# EasyEDA Pro project G431CBU6最小系统板_v2.0_RT9013-33GB_2024-07-07.epro

# Schematic G431CBU6最小系统板
Create Date: 2024-06-30; Page Name: P1; Project Name: G431CBU6; Schematic Name: G431CBU6最小系统板; Update Date: 2024-07-07; Company: 无线电爱好者协会; Drawed: wuneng; Page Size: A4; Version: V2.0
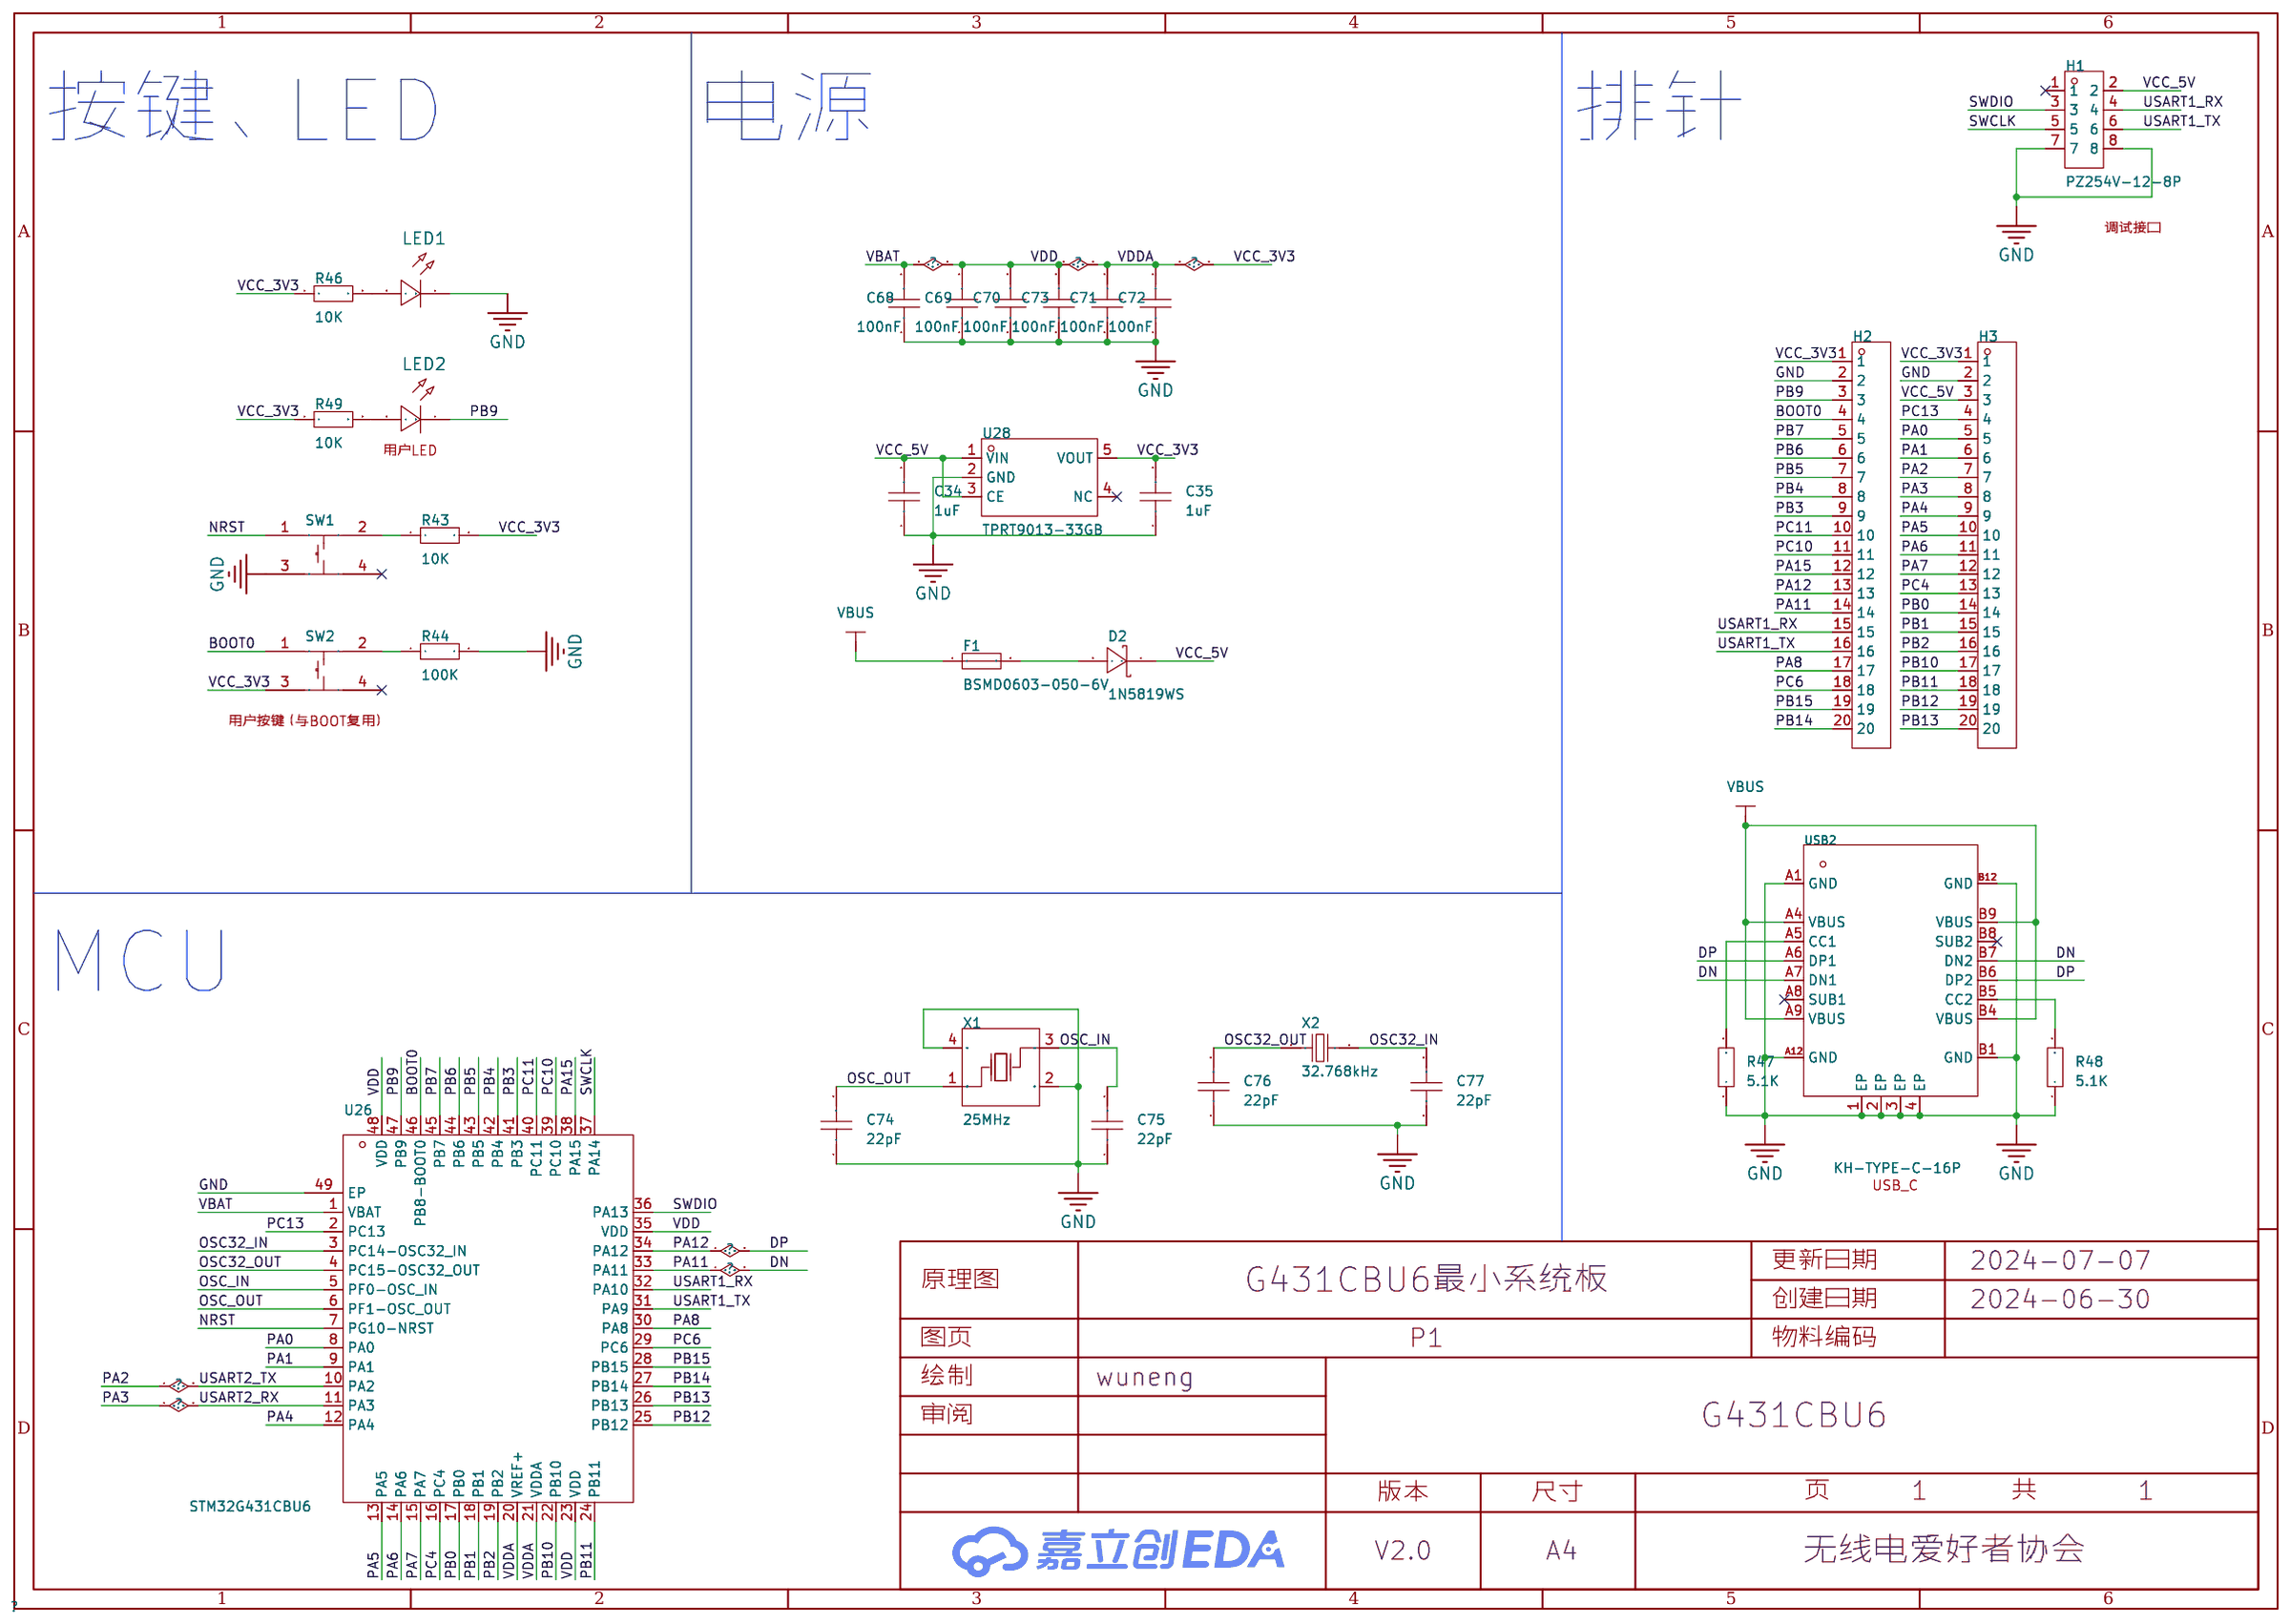
[diagram p0: schematic sheet]

## Parts
C34  1uF  [C0603]
C35  1uF  [C0603]
C68  100nF  [C0603]
C69  100nF  [C0603]
C70  100nF  [C0603]
C71  100nF  [C0603]
C72  100nF  [C0603]
C73  100nF  [C0603]
C74  22pF  [C0402]
C75  22pF  [C0402]
C76  22pF  [C0402]
C77  22pF  [C0402]
D2  1N5819WS  [SOD-323_L1.8-W1.3-LS2.5-RD]
F1  BSMD0603-050-6V  [F0603]
H1  PZ254V-12-8P  [HDR-TH_8P-P2.54-V-M-R2-C4-S2.54]
H2  X6511WV-20H-C60D30  [HDR-TH_20P-P2.54-V-M]
H3  X6511WV-20H-C60D30  [HDR-TH_20P-P2.54-V-M]
LED1  -  [LED_0603]
LED2  -  [LED_0603]
R43  10K  [R0603]
R44  100K  [R0603]
R46  10K  [R0603]
R47  5.1K  [R0603]
R48  5.1K  [R0603]
R49  10K  [R0603]
SW1  K2-1808SN-A3SW-01  [SW-SMD_4P-L4.2-W3.3-P2.15-LS5.1]
SW2  K2-1808SN-A3SW-01  [SW-SMD_4P-L4.2-W3.3-P2.15-LS5.1]
U26  STM32G431CBU6  [UFQFPN-48_L7.0-W7.0-P0.50-BL-EP]
U28  TPRT9013-33GB  [SOT-23-5_L3.0-W1.7-P0.95-LS2.8-BL]
USB2  KH-TYPE-C-16P  [USB-C-SMD_KH-TYPE-C-16P]
X1  25MHz  [OSC-SMD_4P-L3.2-W2.5-BL]
X2  32.768kHz  [FC-135R_L3.2-W1.5]

## Library data of the parts
C34 C35 C68-C73 = CAP_0603: Supplier Footprint: 0603
C74-C77 = CAP_0402: Supplier Footprint: 0402
D2 = 1N5819WS_C191023: 正向压降(Vf):600mV@1A;直流反向耐压(Vr):40V;平均整流电流(Io):1A;; LCSC Part Name: 电压:40V 电流:1A; Supplier Part: C191023; Manufacturer: Hottech(合科泰); Supplier Footprint: SOD-323; JLCPCB Part Class: 基础库; Datasheet: https://atta.szlcsc.com/upload/public/pdf/source/20220428/3CB86FD8D28D653594B4E35F9D5AEFD9.pdf; Supplier: LCSC; Forward Voltage (Vf@If): 600mV@1A; Reverse Voltage (Vr): 40V; Average Rectified Current (Io): 1A
F1 = BSMD0603-050-6V: 最大电压:6V;最大电流:40A;保持电流:500mA;跳闸电流:1A;; LCSC Part Name: 6V 500mA 0603自恢复; Supplier Part: C883095; Manufacturer: BHFUSE(佰宏); Supplier Footprint: 0603; JLCPCB Part Class: 扩展库; Datasheet: https://atta.szlcsc.com/upload/public/pdf/source/20230512/E478DE3555A0061DA0124A9F45802B86.pdf; Supplier: LCSC; Operating Voltage (Max): 6V; Current Rating (Max): 40A; Hold Current: 500mA; Trip Current: 1A; Power Dissipation: 500mW; Resistance - Initial (Ri) (Min): 100mΩ; Resistance - Post Trip (R1) (Max): 800mΩ; Maximum Time to Trip: 100ms; Operating Temperature: -40℃~+85℃
H1 = PZ254V-12-8P: 插针结构:2x4P;间距:2.54mm;行距:2.54mm;圆针/方针:方针;安装类型:直插;排数:双排;总PIN位数:8P;额定电流:-;额定电压:-;配合针长度:6mm;塑高:2.5mm;端接针长度:3mm;触头材质:黄铜;触头镀层:-;工作温度范围:-40℃~+105℃;颜色:黑色;; LCSC Part Name: 间距:2.54mm 2x4P 直插 方针; Supplier Part: C492421; Manufacturer: XFCN(兴飞); Supplier Footprint: 插件,P=2.54mm; JLCPCB Part Class: 扩展库; Datasheet: https://atta.szlcsc.com/upload/public/pdf/source/20200309/C492421_DC8A206AF99CD7755BD4A5B0BC48200B.pdf; Supplier: LCSC; Pin Structure: 2x4P; Pitch: 2.54mm; Row Spacing: 2.54mm; Circluar Pins/Square Pins: 方针; Mounting Type: 直插; Number of Rows: 双排; Number of Pins: 8P; Length of Mating Pin: 6mm; Insulation Height: 2.5mm; Length of End Connection Pin: 3mm; Contact Material: 黄铜; Operating Temperature Range: -40℃~+105℃; Color: 黑色
H2 H3 = X6511WV-20H-C60D30: 插针结构:1x20P;间距:2.54mm;行距:2.54mm;圆针/方针:方针;安装类型:-;排数:单排;总PIN位数:20P;额定电流:3A;额定电压:250V;配合针长度:6mm;塑高:2.5mm;端接针长度:3mm;触头材质:黄铜;触头镀层:金;工作温度范围:-40℃~+105℃;焊接温度(最大值):260℃;颜色:黑色;; LCSC Part Name: 1x20P 间距:2.54mm 方针; Supplier Part: C725952; Manufacturer: XKB Connection(中国星坤); Supplier Footprint: 插件,P=2.54mm; JLCPCB Part Class: 扩展库; Datasheet: https://atta.szlcsc.com/upload/public/pdf/source/20221108/2FDDF9C694C8EDC81165E23F2EAAE597.pdf; Supplier: LCSC; Pin Structure: 1x20P; Pitch: 2.54mm; Row Spacing: 2.54mm; Circluar Pins/Square Pins: 方针; Number of Rows: 单排; Number of Pins: 20P; Current Rating (Max): 3A; Voltage Rating (Max): 250V; Length of Mating Pin: 6mm; Insulation Height: 2.5mm; Length of End Connection Pin: 3mm; Contact Material: 黄铜; Contact Plating: 金; Operating Temperature Range: -40℃~+105℃; Soldering Temperature(Max): 260℃; Color: 黑色
LED1 LED2 = LED_0603-R: Supplier Footprint: 0603
R43 R44 R46-R49 = Res_0603: Supplier Footprint: 0603
SW1 SW2 = K2-1808SN-A3SW-01: 作用力:180gf;安装方式:立贴;开关长度:4.2mm;开关宽度:3.25mm;开关高度:2.5mm;触点电流:50mA;额定电压(DC):12V;绝缘电阻:100MΩ;机械寿命:10万次;; LCSC Part Name: 3*4*2.5 贴片开关180G; Supplier Part: C2690012; Manufacturer: 韩国韩荣; Supplier Footprint: SMD; JLCPCB Part Class: 扩展库; Datasheet: https://atta.szlcsc.com/upload/public/pdf/source/20180927/C283535_7E7907F3E7B6C1691E1DC87E363D082A.pdf; Supplier: LCSC; Operating Force: 180gf; Mounting Style: 立贴; Switch Length: 4.2mm; Switch Width: 3.25mm; Switch Height: 2.5mm; Contact Current: 50mA; Voltage Rating (DC): 12V; Insulation Resistance: 100MΩ; Mechanical Life: 10万次; Operating Temperature: -25℃~+85℃
U26 = STM32G431CBU6: CPU内核:ARM-M系列;程序存储容量:128KB;RAM总容量:32KB;GPIO端口数量:42;工作电压范围:1.71V~3.6V;CPU最大主频:170MHz;程序存储器类型:FLASH;; Supplier Part: C529356; Manufacturer: ST(意法半导体); Supplier Footprint: UFQFPN-48(7x7); JLCPCB Part Class: 扩展库; Datasheet: https://atta.szlcsc.com/upload/public/pdf/source/20200511/C529354_7C66CF00837B904D0C15DCE45B69418C.pdf; Supplier: LCSC; CPU Core: ARM-M系列; Program Storage Size: 128KB; RAM Size: 32KB; GPIO Ports Number: 42; Operating Voltage Range: 1.71V~3.6V; CPU Maximum Speed: 170MHz; Program Memory Type: FLASH; Operating Temperature Range: -40℃~+85℃; ADC (Bit): 12bit; DAC (Bit): 12bit; Peripheral/Function: DMA；PWM; Watchdog: 有; Infrared Data Association: 有; Low-Voltage Detect: 有; Direct Memory Access: 有; Internal Oscillator: 有
U28 = TPRT9013-33GB: 输出类型:-;; Supplier Part: C587158; Manufacturer: TECH PUBLIC(台舟); Supplier Footprint: SOT-23-5; JLCPCB Part Class: 扩展库; Datasheet: https://atta.szlcsc.com/upload/public/pdf/source/20210810/692D4D0C3CF190F9330EFD28C3E572CB.pdf; Supplier: LCSC
USB2 = KH-TYPE-C-16P: Type-C母座 16PIN 立式四角贴板无压片; LCSC Part Name: Type-C母座; Supplier Part: C709357; Manufacturer: kinghelm(金航标); JLCPCB Part Class: Extended Part; Datasheet: https://atta.szlcsc.com/upload/public/pdf/source/20200911/C709357_AA8DCEB38BB20E3035A7ED7AE7667837.pdf; Supplier: LCSC; Connector Type: Type-C; Gender: 母; Number of Ports: 1; Number of Contacts: 16P; Mounting Style: 卧贴; Current Rating - Power (Max): 3A; Operating Temperature Range: -40℃~+85℃
X1 = X322525MOB4SI: 晶振类型:贴片晶振;频率:25MHz;常温频差:±10ppm;外接负载电容:12pF;频率稳定度(全温):±20ppm;; LCSC Part Name: 25MHz ±10ppm 12pF; Supplier Part: C9006; Manufacturer: YXC(扬兴晶振); Supplier Footprint: SMD3225-4P; JLCPCB Part Class: 基础库; Datasheet: https://atta.szlcsc.com/upload/public/pdf/source/20240329/19D5F850207469550BEB00D7DFEDBC7A.pdf; Supplier: LCSC; Crystal Type: 贴片晶振; Normal temperature Frequency Tolerance: ±10ppm; External load capacitor: 12pF; Frequency Stability(Full temperature range): ±20ppm; Operating Temperature: -40℃~+85℃
X2 = Q13FC13500004_C32346: 晶振类型:贴片晶振;频率:32.768kHz;常温频差:±20ppm;外接负载电容:12.5pF;; LCSC Part Name: 32.768kHz ±20ppm 12.5pF; Supplier Part: C32346; Manufacturer: EPSON(爱普生); Manufacturer Part: Q13FC13500004; Supplier Footprint: SMD3215-2P; JLCPCB Part Class: Basic Part; Datasheet: https://atta.szlcsc.com/upload/public/pdf/source/20240418/0E0FF5F0356BA3753F616001439D1416.pdf; Supplier: LCSC; Crystal Type: 贴片晶振; Normal temperature Frequency Tolerance: ±20ppm; External load capacitor: 12.5pF; Equivalent Series Resistance (ESR): 70kΩ; Operating Temperature: -40℃~+85℃

## Nets
GND: C34.1 C35.1 C68.1 C69.1 C70.1 C71.1 C72.1 C73.1 C74.1 C75.1 C76.1 C77.1 H1.7 H1.8 H2.2 H3.2 LED1.1(C) R44.2 R47.1 R48.1 SW1.3 U26.49(EP) U28.2(GND) USB2.1(EP) USB2.2(EP) USB2.3(EP) USB2.4(EP) USB2.A1(GND) USB2.A12(GND) USB2.B1(GND) USB2.B12(GND) X1.2(GND) X1.4(GND)
VBAT: C35.2 C68.2 C69.2 C70.2 C71.2 C72.2 C73.2 H2.1 H3.1 R43.2 R46.1 R49.1 SW2.3 U26.1(VBAT) U26.20(VREF+) U26.21(VDDA) U26.23(VDD) U26.35(VDD) U26.48(VDD) U28.5(VOUT)
VBUS: F1.1 USB2.A4(VBUS) USB2.A9(VBUS) USB2.B4(VBUS) USB2.B9(VBUS)
VCC_5V: C34.2 D2.1(K) H1.2 H3.3 U28.1(VIN) U28.3(CE)
BOOT0: H2.4 SW2.1 U26.46(PB8-BOOT0)
DN: H2.14 U26.33(PA11) USB2.A7(DN1) USB2.B7(DN2)
DP: H2.13 U26.34(PA12) USB2.A6(DP1) USB2.B6(DP2)
NRST: SW1.1 U26.7(PG10-NRST)
OSC32_IN: C77.2 U26.3(PC14-OSC32_IN) X2.2
OSC32_OUT: C76.2 U26.4(PC15-OSC32_OUT) X2.1
OSC_IN: C75.2 U26.5(PF0-OSC_IN) X1.3(OSC2)
OSC_OUT: C74.2 U26.6(PF1-OSC_OUT) X1.1(OSC1)
PA0: H3.5 U26.8(PA0)
PA1: H3.6 U26.9(PA1)
PA2: H3.7 U26.10(PA2)
PA3: H3.8 U26.11(PA3)
PA4: H3.9 U26.12(PA4)
PA5: H3.10 U26.13(PA5)
PA6: H3.11 U26.14(PA6)
PA7: H3.12 U26.15(PA7)
PA8: H2.17 U26.30(PA8)
PA15: H2.12 U26.38(PA15)
PB0: H3.14 U26.17(PB0)
PB1: H3.15 U26.18(PB1)
PB2: H3.16 U26.19(PB2)
PB3: H2.9 U26.41(PB3)
PB4: H2.8 U26.42(PB4)
PB5: H2.7 U26.43(PB5)
PB6: H2.6 U26.44(PB6)
PB7: H2.5 U26.45(PB7)
PB9: H2.3 LED2.1(C) U26.47(PB9)
PB10: H3.17 U26.22(PB10)
PB11: H3.18 U26.24(PB11)
PB12: H3.19 U26.25(PB12)
PB13: H3.20 U26.26(PB13)
PB14: H2.20 U26.27(PB14)
PB15: H2.19 U26.28(PB15)
PC4: H3.13 U26.16(PC4)
PC6: H2.18 U26.29(PC6)
PC10: H2.11 U26.39(PC10)
PC11: H2.10 U26.40(PC11)
PC13: H3.4 U26.2(PC13)
SWCLK: H1.5 U26.37(PA14)
SWDIO: H1.3 U26.36(PA13)
USART1_RX: H1.4 H2.15 U26.32(PA10)
USART1_TX: H1.6 H2.16 U26.31(PA9)
$1N959: R43.1 SW1.2
$1N967: R44.1 SW2.2
$1N3403: D2.2(A) F1.2
$1N5948: LED1.2(A) R46.2
$1N7792: R48.2 USB2.B5(CC2)
$1N7796: R47.2 USB2.A5(CC1)
$1N10454: LED2.2(A) R49.2

Not connected (* = marked no-connect by the designer): H1 1*; SW1 4*; SW2 4*; U28 4(NC)*; USB2 A8(SUB1)* B8(SUB2)*

## Notes on the sheet
- 按键、LED
- 电源
- 排针
- 调试接口
- 用户LED
- 用户按键（与BOOT复用）
- MCU
- USB_C

# Board G431CBU6最小系统板
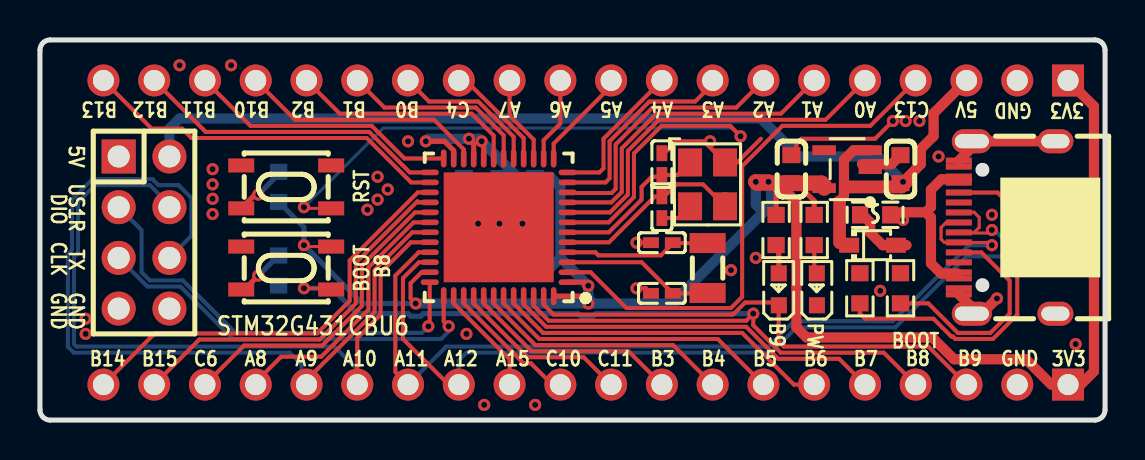
[diagram p1: board, top side]
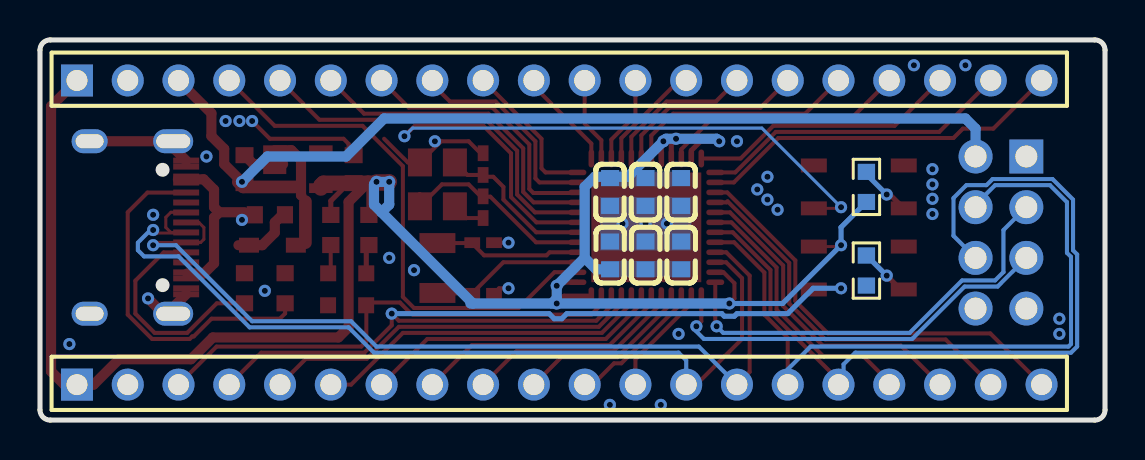
[diagram p2: board, bottom side, seen from below]

Outline 53.29 x 19.05 mm; copper layers: Top Layer, Bottom Layer. Coordinates in mm from the lower left corner of the outline.
Outline path: 0,18.54 0,0.51 arc(0.15,0.15) 0.51,0 52.78,0 arc(53.14,0.15) 53.29,0.51 53.29,18.54 arc(53.14,18.9) 52.78,19.05 0.51,19.05 arc(0.15,18.9) 0,18.54
Stack: Top Layer 0.035mm / Dielectric1 1.51mm FR4 er 4.5 / Bottom Layer 0.035mm

## Design rules (mm)
template: JLCPCB Capability(Two Layers Board)
spacing copperThickness1oz (default): track to track 0.102, other pairs 0.152 to 0.3
spacing copperThickness2oz: track to track 0.203, other pairs 0.152 to 0.3
track width copperThickness1oz (default): min 0.127, default 0.254, max 2.54
track width copperThickness2oz: min 0.203, default 0.254, max 2.54
differential pair differentialPair (default): width min 0.127, default 0.254, max 2.54; gap min 0.152, default 0.152
via viaSize (default): diameter min 0.5, default 0.61, max 10; hole min 0.3, default 0.305, max 6.3

## Placement (name value [footprint] x y rotation side)
C34  1uF  [C0603]  43.05 12.57 270 top
C35  1uF  [C0603]  37.59 12.57 270 top
C68  100nF  [C0603]  22.99 11.43 90 bottom
C69  100nF  [C0603]  24.77 11.43 90 bottom
C70  100nF  [C0603]  21.21 11.43 90 bottom
C71  100nF  [C0603]  22.99 8.26 270 bottom
C72  100nF  [C0603]  24.77 8.26 270 bottom
C73  100nF  [C0603]  21.21 8.26 270 bottom
C74  22pF  [C0402]  31.11 12.83 270 top
C75  22pF  [C0402]  31.11 10.67 90 top
C76  22pF  [C0402]  31.11 8.89 0 top
C77  22pF  [C0402]  31.11 6.35 0 top
D2  1N5819WS  [SOD-323_L1.8-W1.3-LS2.5-RD]  41.66 8.76 0 top
F1  BSMD0603-050-6V  [F0603]  41.78 10.29 180 top
H1  PZ254V-12-8P  [HDR-TH_8P-P2.54-V-M-R2-C4-S2.54]  5.21 9.4 270 top
H2  X6511WV-20H-C60D30  [HDR-TH_20P-P2.54-V-M]  27.3 1.78 180 bottom
H3  X6511WV-20H-C60D30  [HDR-TH_20P-P2.54-V-M]  27.3 17.02 180 bottom
LED1  -  [LED_0603]  38.86 6.6 90 top
LED2  -  [LED_0603]  36.96 6.6 90 top
R43  10K  [R0603]  11.94 11.68 270 bottom
R44  100K  [R0603]  11.94 7.49 270 bottom
R46  10K  [R0603]  38.73 9.53 270 top
R47  5.1K  [R0603]  43.05 6.6 270 top
R48  5.1K  [R0603]  41.02 6.6 270 top
R49  10K  [R0603]  36.83 9.53 270 top
SW1  K2-1808SN-A3SW-01  [SW-SMD_4P-L4.2-W3.3-P2.15-LS5.1]  12.32 11.68 180 top
SW2  K2-1808SN-A3SW-01  [SW-SMD_4P-L4.2-W3.3-P2.15-LS5.1]  12.32 7.62 180 top
U26  STM32G431CBU6  [UFQFPN-48_L7.0-W7.0-P0.50-BL-EP]  22.95 9.66 90 top
U27  -  [JLC-QRCODE-5x5]  50.55 9.65 0 top
U28  TPRT9013-33GB  [SOT-23-5_L3.0-W1.7-P0.95-LS2.8-BL]  40.39 12.57 90 top
USB2  KH-TYPE-C-16P  [USB-C-SMD_KH-TYPE-C-16P]  48.39 9.65 90 top
X1  25MHz  [OSC-SMD_4P-L3.2-W2.5-BL]  33.4 11.81 270 top
X2  32.768kHz  [FC-135R_L3.2-W1.5]  33.4 7.62 270 top

## Footprints (pads in the part's own frame, mm; a bottom-side part is the same pattern mirrored in y, then rotated)
C0402
  rect 0.79x0.54 smd: 1(-0.545,0) 2(0.545,0)
C0603
  rect 0.8x0.9 smd: 1(-0.7,0) 2(0.7,0)
F0603
  rect 0.806x0.864 smd: 1(-0.753,0) 2(0.753,0)
FC-135R_L3.2-W1.5
  rect 1x1.8 smd: 1(-1.25,0) 2(1.25,0)
HDR-TH_8P-P2.54-V-M-R2-C4-S2.54
  rect 1.7x1.7 hole 1.1: 1(-3.81,-1.27)
  round 1.7 hole 1.1: 2(-3.81,1.27) 3(-1.27,-1.27) 4(-1.27,1.27) 5(1.27,-1.27) 6(1.27,1.27) 7(3.81,-1.27) 8(3.81,1.27)
HDR-TH_20P-P2.54-V-M
  rect 1.6x1.6 hole 1.05: 1(-24.13,0)
  round 1.6 hole 1.05: 2(-21.59,0) 3(-19.05,0) 4(-16.51,0) 5(-13.97,0) 6(-11.43,0) 7(-8.89,0) 8(-6.35,0) 9(-3.81,0) 10(-1.27,0) 11(1.27,0) 12(3.81,0) 13(6.35,0) 14(8.89,0) 15(11.43,0) 16(13.97,0) 17(16.51,0) 18(19.05,0) 19(21.59,0) 20(24.13,0)
LED_0603
  rect 0.8x0.8 smd: 1(-0.851,-0.01) 2(0.75,-0.005)
OSC-SMD_4P-L3.2-W2.5-BL
  rect 1.4x1.2 smd: 1(-1.1,-0.875) 2(1.1,-0.875) 3(1.1,0.875) 4(-1.1,0.875)
R0603
  rect 0.806x0.864 smd: 1(-0.753,0) 2(0.753,0)
SOD-323_L1.8-W1.3-LS2.5-RD
  rect 1x0.75 smd: 1(-1.173,0) 2(1.173,0)
SOT-23-5_L3.0-W1.7-P0.95-LS2.8-BL
  rect 0.49x1.157 smd: 1(-0.95,-1.153) 2(0,-1.153) 3(0.95,-1.153)
  rect 0.49x1.175 smd: 4(0.95,1.153) 5(-0.95,1.153)
SW-SMD_4P-L4.2-W3.3-P2.15-LS5.1
  rect 1.3x0.7 smd: 1(-2.25,1.075) 2(2.25,1.075) 3(-2.25,-1.075) 4(2.25,-1.075)
UFQFPN-48_L7.0-W7.0-P0.50-BL-EP
  oval 0.28x0.9 smd: 1(-2.751,-3.45) 2(-2.251,-3.45) 3(-1.75,-3.45) 4(-1.25,-3.45) 5(-0.749,-3.45) 6(-0.249,-3.45) 7(0.249,-3.45) 8(0.75,-3.45) 9(1.25,-3.45) 10(1.75,-3.45) 11(2.251,-3.45) 12(2.751,-3.45) 25(2.751,3.449) 26(2.251,3.449) 27(1.75,3.449) 28(1.25,3.449) 29(0.75,3.449) 30(0.249,3.449) 31(-0.249,3.449) 32(-0.749,3.449) 33(-1.25,3.449) 34(-1.75,3.449) 35(-2.251,3.449) 36(-2.751,3.449)
  oval 0.9x0.28 smd: 13(3.45,-2.751) 14(3.45,-2.251) 15(3.45,-1.75) 16(3.45,-1.25) 17(3.45,-0.75) 18(3.45,-0.249) 19(3.45,0.249) 20(3.45,0.749) 21(3.45,1.25) 22(3.45,1.75) 23(3.45,2.251) 24(3.45,2.751) 37(-3.449,2.751) 38(-3.449,2.251) 39(-3.449,1.75) 40(-3.449,1.25) 41(-3.449,0.749) 42(-3.449,0.249) 43(-3.449,-0.249) 44(-3.449,-0.75) 45(-3.449,-1.25) 46(-3.449,-1.75) 47(-3.449,-2.251) 48(-3.449,-2.751)
  rect 5.5x5.5 smd: 49(0,0)
USB-C-SMD_KH-TYPE-C-16P
  oval 1.2x2 hole 0.7x1.7: 1(-4.32,1.765) 2(4.32,1.765)
  oval 1.2x1.8 hole 0.7x1.4: 3(-4.32,-2.415) 4(4.32,-2.415)
  rect 0.3x1.3 smd: A1(-3.35,2.415) A4(-2.55,2.415) A5(-1.25,2.415) A6(-0.25,2.415) A7(0.25,2.415) A8(1.25,2.415) A9(2.55,2.415) A12(3.35,2.415) B1(3.05,2.415) B4(2.25,2.415) B5(1.75,2.415) B6(0.75,2.415) B7(-0.75,2.415) B8(-1.75,2.415) B9(-2.25,2.415) B12(-3.05,2.415)

## Nets
As in the schematic.

Pads without a net: H1 1; SW1 4; SW2 4; U28 4; USB2 A8 B8

## Via types
v1: diameter 0.61, hole 0.305, Top Layer to Bottom Layer, 53 vias

## Routing (per net, layer and track width the routed paths; a pad name or vN(x,y) marks a point on that pad's centre or on a via; arc(x,y) is an arc through that point)
GND: length 25.3
  Top Layer w0.203: 36.07,14.1 34.88,12.91 X1.4 33.22,13.97 31.84,13.97 31.24,13.37 ; C77.1 30.32,6.6 v1(29.85,6.6) ; X1.2 31.94,10.12 31.24,10.12 ; v1(42.67,14.99) 41.78,14.1 38.1,14.1 37.85,13.84 37.85,13.27 ; v1(29.85,8.89) C76.1
  Top Layer w0.508: 41.12,12.83 42.61,12.83 C34.1 ; USB2.A1 46.62,5.65 USB2.1 47.11,5.33 v1(47.88,6.1) ; USB2.A12 46.62,13.65 USB2.2 USB2.4
  vias: v1(2.29,5.08) v1(2.29,4.32) v1(6.98,17.78) v1(8.64,12.57) v1(8.64,11.81) v1(8.64,11.09) v1(8.64,10.33) v1(9.56,17.78) v1(16.38,10.54) v1(16.89,12.19) v1(16.89,11.05) v1(17.4,11.56) v1(18.42,13.97) v1(21.34,4.32) v1(21.92,9.84) v1(22.23,0.76) v1(22.99,9.84) v1(24.14,9.84) v1(24.77,0.76) v1(33.53,13.97) v1(34.57,7.51) v1(35.81,8.13) v1(42.04,6.48) v1(43.31,14.99) v1(44,14.99) v1(44.96,13.21) v1(47.63,10.29) v1(51.82,3.81)
VBAT: length 106.5
  Top Layer w0.152: v1(13.21,8.76) 13.28,8.7 SW2.3
  Top Layer w0.203: U26.35 19.09,7.41 18.54,6.86 18.54,6.1 v1(18.8,5.84)
  Top Layer w0.254: v1(27.43,5.84) 27.06,6.21 U26.48 ; v1(19.3,13.97) 20.24,13.97 20.47,13.74 ; v1(27.43,6.73) 27.26,6.91 U26.1 ; v1(36.45,11.94) 36.77,11.94 36.83,11.87 R49.1 ; U26.20 22.2,13.87 v1(22.1,13.97) ; 37.85,11.87 38.73,10.98 R46.1 ; v1(21.46,14.1) 21.7,13.86 U26.21 ; 20.52,13.69 20.7,13.51 U26.23
  Top Layer w0.508: H3.1 52.73,15.72 52.73,2.44 52.07,1.78 H2.1 50.6,1.78 49.33,3.05 45.73,3.05 44.64,4.14 38.35,4.14 37.85,4.65 37.85,10.93 36.91,11.87
  Top Layer w0.762: U28.5 39.23,11.75 39.11,11.87 35.88,11.87 v1(35.81,11.94) v1(36.45,11.94)
  Bottom Layer w0.254: v1(18.8,5.84) 16.13,5.84 v1(13.21,8.76) 13.21,9.66 R43.2
  Bottom Layer w0.508: C72.2 25.46,7.56 26.04,8.13 ; 26.04,8.13 26.04,11.68 25.53,12.19 23.88,12.19 v1(22.1,13.97) 21.97,14.1 v1(21.46,14.1) 19.43,14.1 v1(19.3,13.97) ; 26.04,8.13 v1(27.43,6.73) 27.43,6.1 27.69,5.84 v1(27.43,5.84) v1(18.8,5.84) ; 36.2,10.41 35.81,10.8 v1(35.81,11.94) v1(36.45,11.94) 36.58,11.81 36.58,10.8 36.2,10.41 ; 36.2,10.41 31.62,5.84 ; 31.62,5.84 31.75,5.84 ; 31.62,5.84 27.81,5.84
VBUS: length 8.8
  Top Layer w0.508: 45.92,7.35 45.08,7.35 44.58,7.85 44.58,10.15 44.32,10.41 44.32,10.41 ; 44.32,10.41 43.04,10.41 ; 44.32,10.41 44.58,10.67 44.58,11.55 45.1,12.06 46.38,12.06
  vias: v1(43.18,10.03)
VCC_5V: length 54.4
  Top Layer w0.508: v1(43.18,11.94) 44.07,12.83 44.07,13.59 44.71,14.23 44.71,15.37 H3.3 ; U28.3 40.71,13.52 40.23,13.04 40.23,11.27 40.21,11.25
  Top Layer w0.635: 40.01,10.95 40.01,8.89 ; 40.44,11.68 43.12,11.68 43.36,11.93
  Bottom Layer w0.508: 6.48,13.21 6.48,14.61 6.98,15.11 36.07,15.11 37.97,13.21 41.91,13.21 v1(43.18,11.94)
BOOT0: length 46.6
  Top Layer w0.152: SW2.1 14.51,6.6 v1(13.21,6.6)
  Top Layer w0.203: 43.82,1.78 42.21,3.38 37.06,3.38 35.69,4.75 v1(35.69,5.33) 35.33,4.98 25.45,4.98 24.7,5.73 U26.46
  Bottom Layer w0.254: v1(13.21,6.6) 14.61,6.6 15.88,5.33 18.42,5.33 18.54,5.21 19.05,5.21 19.18,5.33 26.92,5.33 27.18,5.08 27.56,5.08 27.81,5.33 v1(35.69,5.33)
DN: length 44.3
  Top Layer w0.152: USB2.A7 45.33,9.9 45.08,9.65 45.08,9.06 45.25,8.9 USB2.B7 47.49,8.9 v1(47.63,8.76)
  Top Layer w0.203: 18.42,1.78 17.78,2.41 17.78,7.24 18.95,8.41 U26.33
  Bottom Layer w0.203: 18.42,1.78 20.32,3.68 36.45,3.68 37.72,4.95 42.67,4.95 46.48,8.76 v1(47.63,8.76)
DP: length 45.3
  Top Layer w0.152: 45.98,9.4 45.95,9.37 47.47,9.37 v1(47.63,9.53) ; 45.98,9.4 USB2.A6 ; 45.98,9.4 46.74,9.4 46.99,9.65 46.99,10.16 46.74,10.41 45.98,10.41 USB2.B6
  Top Layer w0.203: U26.34 18.96,7.91 18.16,7.11 18.16,4.06 20.45,1.78 H2.13
  Bottom Layer w0.203: v1(47.63,9.53) 47.75,9.53 48.39,8.89 48.39,8.51 48.08,8.2 46.35,8.2 42.8,4.65 37.85,4.65 36.58,3.38 21.34,3.38 20.95,3 H2.13
NRST: length 37.2
  Top Layer w0.152: v1(13.21,10.67) 13.27,10.61 SW1.1
  Top Layer w0.203: v1(35.05,14.22) 34.53,14.75 31.1,14.75 29.72,13.37 29.72,11.18 28.45,9.91 U26.7
  Bottom Layer w0.152: v1(35.05,14.22) 34.65,14.63 17.17,14.63 v1(13.21,10.67)
OSC32_IN: length 7.7
  Top Layer w0.203: X2.2 33.38,6.35 C77.2 30.1,7.91 U26.3
OSC32_OUT: length 7.3
  Top Layer w0.203: 31.68,8.87 31.07,8.26 27.94,8.26 27.79,8.41 U26.4 ; 31.68,8.87 X2.1 ; 31.68,8.87 C76.2
OSC_IN: length 10.1
  Top Layer w0.203: 31.24,11.21 31.84,11.81 33.18,11.81 X1.3 ; U26.5 28.47,8.91 30.75,11.19 31.24,11.19
  Top Layer w0.254: 34.29,11.3 34.28,11.29 X1.3
OSC_OUT: length 7.8
  Top Layer w0.203: U26.6 28.46,9.41 30.1,11.05 30.1,11.68 30.61,12.19 31.02,12.19 C74.2 ; X1.1 31.9,12.28 31.24,12.28
PA0: length 18.9
  Top Layer w0.203: U26.8 28.52,10.41 29.41,11.3 29.41,13.49 30.97,15.05 39.31,15.05 H3.5
PA1: length 16.1
  Top Layer w0.203: H3.6 37.07,15.35 30.85,15.35 29.11,13.62 29.11,11.43 28.59,10.91 U26.9
PA2: length 13.5
  Top Layer w0.203: H3.7 34.84,15.66 30.65,15.66 28.8,13.81 28.8,11.58 28.6,11.38 26.43,11.38 U26.10
PA3: length 10.6
  Top Layer w0.203: U26.11 28.3,11.91 28.5,12.11 28.5,13.97 30.49,15.96 32.78,15.96 33.65,16.84 H3.8
PA4: length 7.5
  Top Layer w0.203: H3.9 28.19,14.1 28.19,12.61 27.99,12.41 U26.12
PA5: length 5.1
  Top Layer w0.203: H3.10 28.58,16.73 25.7,13.86 U26.13
PA6: length 4.8
  Top Layer w0.203: U26.14 25.2,14.02 26.04,14.86 26.04,17.02 26.54,17.02
PA7: length 4.4
  Top Layer w0.203: H3.12 23.49,15.26 24.7,14.06 U26.15
PA8: length 13.4
  Top Layer w0.203: H2.17 10.8,1.91 12.07,3.17 14.07,3.17 16.43,5.54 16.43,7.65 18.69,9.91 U26.30
PA15: length 5.6
  Top Layer w0.203: U26.38 20.7,5.84 23.49,3.05 H2.12
PB0: length 7.5
  Top Layer w0.203: U26.17 23.7,14.2 21.93,15.96 19.47,15.96 18.42,17.02
PB1: length 9.6
  Top Layer w0.203: H3.15 17.23,15.66 21.81,15.66 23.2,14.27 U26.18
PB2: length 11.7
  Top Layer w0.203: H3.16 15,15.35 21.6,15.35 22.7,14.26 U26.19
PB3: length 11
  Top Layer w0.203: H2.9 29.44,3.45 24.59,3.45 22.23,5.82 22.23,6.18 U26.41
PB4: length 13
  Top Layer w0.203: H2.8 31.67,3.76 24.78,3.76 22.7,5.84 U26.42
PB5: length 15.2
  Top Layer w0.203: U26.43 23.2,5.84 24.98,4.06 33.91,4.06 H2.7 36.32,1.91
PB6: length 17.1
  Top Layer w0.203: U26.44 23.7,5.84 25.17,4.37 35.13,4.37 37.72,1.78 H2.6
PB7: length 19.2
  Top Layer w0.203: H2.5 39.98,3.07 36.93,3.07 35.33,4.67 25.33,4.67 24.2,5.8 U26.45
PB9: length 24.7
  Top Layer w0.203: H2.3 44.45,3.68 37.21,3.68 36.96,3.94 36.96,5.59 36.65,5.89 35.28,5.89 34.7,5.31 34.66,5.32 34.62,5.28 25.7,5.28 25.2,5.79 U26.47
PB10: length 12.3
  Top Layer w0.203: U26.22 21.2,13.57 19.72,15.05 12.76,15.05 H3.17
PB11: length 13.6
  Top Layer w0.203: 20.2,13.11 18.23,13.11 16.6,14.75 10.53,14.75 8.26,17.02
PB12: length 15.7
  Top Layer w0.203: U26.25 18.5,12.41 16.47,14.44 8.29,14.44 H3.19
PB13: length 18.4
  Top Layer w0.203: U26.26 18.57,11.91 16.35,14.14 7.58,14.14 7.11,14.61 5.59,14.61 H3.20
PB14: length 21.5
  Top Layer w0.203: U26.27 18.9,11.41 15.49,8 15.49,5.97 13.87,4.34 5.74,4.34 H2.20
PB15: length 18.8
  Top Layer w0.203: H2.19 7.98,4.04 13.99,4.04 15.8,5.84 15.8,7.87 18.88,10.96 18.94,10.91 U26.28
PC4: length 5.5
  Top Layer w0.203: H3.13 21.31,17.02 24.2,14.13 U26.16
PC6: length 16
  Top Layer w0.203: 8.26,1.78 10.21,3.73 14.12,3.73 16.1,5.72 16.1,7.75 18.76,10.41 U26.29
PC10: length 6.9
  Top Layer w0.203: 26.04,1.78 25.63,1.78 24.56,2.84 24.2,2.84 21.2,5.84 U26.39
PC11: length 8.9
  Top Layer w0.203: H2.10 27.2,3.15 24.39,3.15 21.7,5.84 U26.40
PC13: length 26.7
  Top Layer w0.203: U26.2 27.55,7.41 29.34,5.62 34.57,5.62 35.13,6.17 35.13,12.73 37.15,14.75 41.54,14.75 43.82,17.02
SWCLK: length 20.2
  Top Layer w0.203: v1(20.45,4.7) 20.2,4.95 20.2,6.21
  Bottom Layer w0.203: v1(20.45,4.7) 20.45,4.45 20.07,4.06 9.65,4.06 7.02,6.69 5.37,6.69 H1.5
SWDIO: length 21.7
  Top Layer w0.203: v1(19.43,4.7) 19.5,4.77 U26.36
  Bottom Layer w0.203: H1.3 5.08,9.53 5.08,7.42 5.5,7 7.15,7 9.78,4.37 19.1,4.37 v1(19.43,4.7)
USART1_RX: length 37.3
  Top Layer w0.203: H2.15 15.88,4.12 17.04,5.29 17.04,7.4 18.56,8.91 U26.32
  Bottom Layer w0.203: 6.48,10.67 6.48,10.8 5.5,11.77 2.76,11.77 1.91,10.92 1.91,8.38 1.7,8.18 1.7,3.81 1.83,3.68 14.73,3.68 15.88,2.54 H2.15
USART1_TX: length 41.6
  Top Layer w0.203: U26.31 18.63,9.41 16.74,7.52 16.74,5.41 13.33,2.01 H2.16
  Bottom Layer w0.203: 6.48,8.13 7.58,9.23 7.58,11.13 6.93,11.77 5.93,11.77 5.63,12.08 2.63,12.08 1.6,11.05 1.6,8.51 1.4,8.31 1.4,3.68 1.7,3.38 12.5,3.38 13.08,2.79 13.08,2.03 H2.16
$1N959: length 2.7
  Top Layer w0.254: v1(10.92,11.3) 10.76,11.3 SW1.2
  Bottom Layer w0.254: v1(10.92,11.3) 11.94,12.32 R43.1
$1N967: length 2.6
  Top Layer w0.254: v1(10.92,7.24) 10.23,6.55 SW2.2
  Bottom Layer w0.254: R44.1 11.93,8.25 v1(10.92,7.24)
$1N3403: length 3.3
  Top Layer w0.508: 41.03,10.41 41.54,9.91 41.54,9.39 42.16,8.76 D2.2 43.36,8.76
$1N5948: length 1.4
  Top Layer w0.203: R46.2 38.74,8.77 38.74,7.35
$1N7792: length 17.9
  Top Layer w0.203: USB2.B5 47.91,11.4 48.89,10.41 48.89,5.28 47.67,4.06 45.8,4.06 45.67,4.19 45.59,4.19 44.7,5.08 41.28,5.08 41.02,5.34 R48.2
$1N7796: length 11.3
  Top Layer w0.203: R47.2 44.44,5.85 45.92,4.37 47.55,4.37 48.51,5.33 48.51,6.98 47.1,8.4 USB2.A5
$1N10454: length 1.5
  Top Layer w0.254: LED2.2 36.96,8.64 R49.2

## Copper pours and planes (outline as drawn; the poured copper is in the pictures)
GND on Top Layer: -0.25,20.19 54.48,20.19 54.48,-1.4 -0.25,-1.4
GND on Bottom Layer: 20.7,11.18 25.27,11.18 25.27,8.51 20.7,8.51
GND on Bottom Layer: -0.51,20.07 53.85,20.07 53.85,-1.27 -0.51,-1.27
VBAT on Bottom Layer: 20.74,7.97 25.17,7.97 25.17,7.17 20.74,7.17
VBAT on Bottom Layer: 20.77,12.51 25.2,12.51 25.2,11.71 20.77,11.71

## Text on the board
Top Silkscreen Layer: RST | BOOT | B14 | B15 | C6 | A8 | A9 | A10 | A11 | A12 | A15 | C10 | C11 | B3 | B4 | B5 | B6 | B7 | B8 | B9 | GND | 3V3 | B13 | B12 | B11 | B10 | B2 | B1 | B0 | C4 | A7 | A6 | A5 | A4 | A3 | A2 | A1 | A0 | C13 | 5V | DIO | CLK | US1R | TX | PW | STM32G431CBU6
